# EAGLE design design1 (EAGLE 9.5.1)

## Sheet 1 of 2: MCU
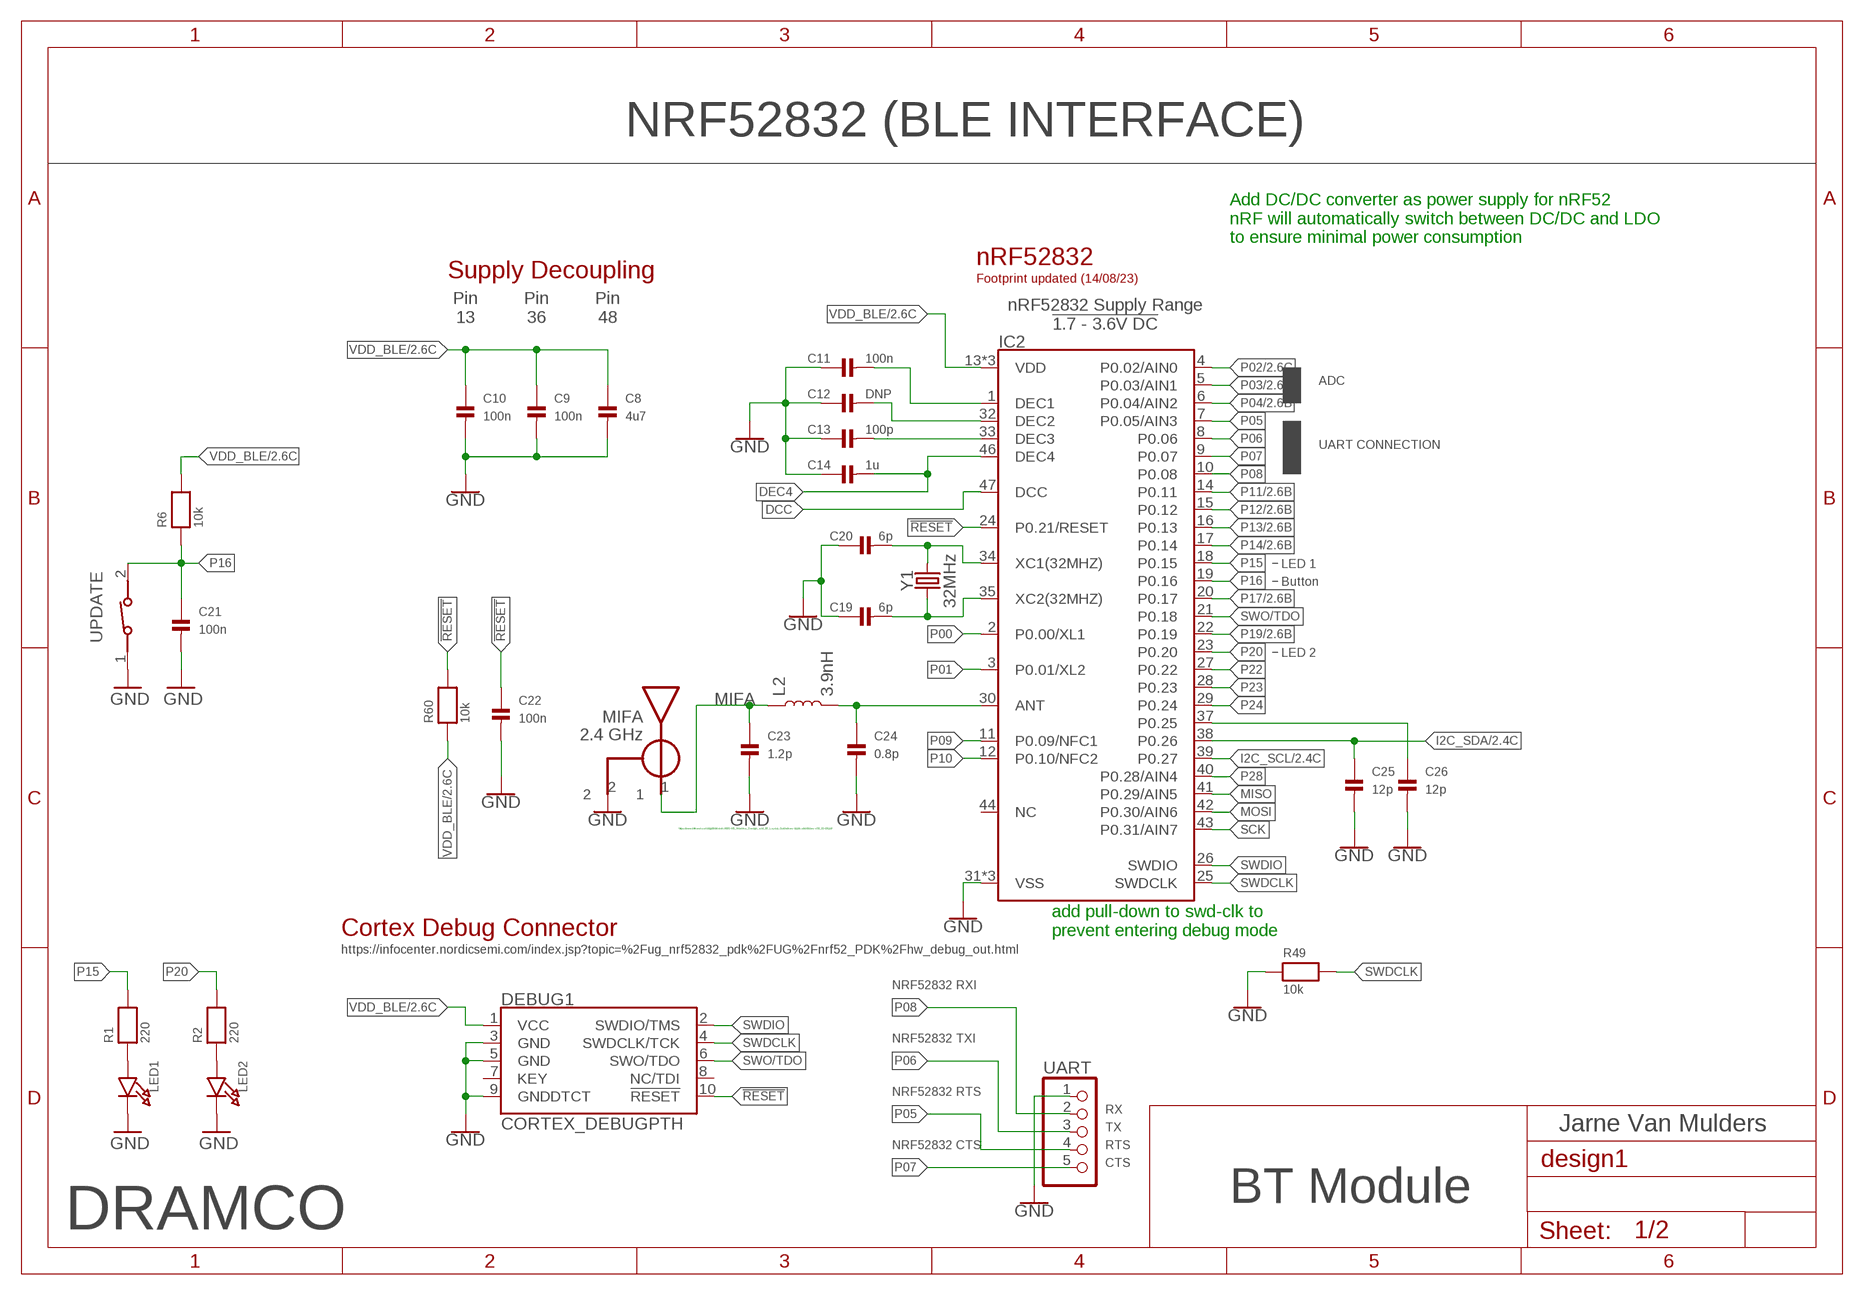
[diagram p0: schematic, sheet 1]

### Parts
C8  4u7  CAP_CERAMIC0603  [0603]
C9  100n  CAP_CERAMIC0402  [0402]
C10  100n  CAP_CERAMIC0402  [0402]
C11  100n  CAP_CERAMIC0402  [0402]
C12  DNP  CAP_CERAMIC0402  [0402]
C13  100p  CAP_CERAMIC0402  [0402]
C14  1u  CAP_CERAMIC0402  [0402]
C19  6p  CAP_CERAMIC0402  [0402]
C20  6p  CAP_CERAMIC0402  [0402]
C21  100n  CAP_CERAMIC0402  [0402]
C22  100n  CAP_CERAMIC0402  [0402]
C23  1.2p  CAP_CERAMIC0402  [0402]
C24  0.8p  CAP_CERAMIC0402  [0402]
C25  12p  CAP_CERAMIC0402  [0402]
C26  12p  CAP_CERAMIC0402  [0402]
DEBUG1  CORTEX_DEBUGPTH  [2X5-PTH-1.27MM]
IC2  NRF52832-EXTENDED  [QFN48-6X6MM-EXTENDED]
L2  3.9nH  INDUCTOR-0402-3.9NH  [0402]
LED1  LED0805  [CHIPLED_0805]
LED2  LED0805  [CHIPLED_0805]
R1  220  RESISTOR0603  [0603]
R2  220  RESISTOR0603  [0603]
R6  10k  RESISTOR0402  [0402]
R49  10k  RESISTOR0402  [0402]
R60  10k  RESISTOR0402  [0402]
U$18  BLE-ANT  [ANT-2G4]
UART  HEADER-1X5ROUND  [1X05_ROUND]
UPDATE  434111043826  [434111043826]
Y1  32MHz  CRYSTAL-32MHZ-SMD-2.0X1.6MM  [CRYSTAL-SMD-2.0X1.6MM]

### Nets
!RESET!: C22.1 DEBUG1.10(!RESET) IC2.24(P0.21/RESET) R60.2
ANT: C24.1 IC2.30(ANT) L2.2
DCC: IC2.47(DCC)
DEC4: C14.2 IC2.46(DEC4)
DEC5: C11.2 IC2.1(DEC1)
DEC6: C12.2 IC2.32(DEC2)
DEC8: C13.2 IC2.33(DEC3)
GND: C8.2 C9.2 C10.2 C11.1 C12.1 C13.1 C14.1 C19.1 C20.1 C21.2 C22.2 C23.2 C24.2 C25.2 C26.2 DEBUG1.3(GND) DEBUG1.5(GND) DEBUG1.9(GNDDTCT) IC2.31(VSS) IC2.45(VSS) IC2.EP(VSS) LED1.C LED2.C R49.1 U$18.2 UART.1 UPDATE.1 ; also sheet 2
I2C_SCL: IC2.39(P0.27) ; also sheet 2
I2C_SDA: C25.1 IC2.38(P0.26) ; also sheet 2
MIFA: C23.1 L2.1 U$18.1
MISO: IC2.41(P0.29/AIN5)
MOSI: IC2.42(P0.30/AIN6)
N$1: LED2.A R2.1
N$20: LED1.A R1.1
N$50: C26.1 IC2.37(P0.25)
P00: IC2.2(P0.00/XL1)
P01: IC2.3(P0.01/XL2)
P02: IC2.4(P0.02/AIN0) ; also sheet 2
P03: IC2.5(P0.03/AIN1) ; also sheet 2
P04: IC2.6(P0.04/AIN2) ; also sheet 2
P05: IC2.7(P0.05/AIN3) UART.4
P06: IC2.8(P0.06) UART.3
P07: IC2.9(P0.07) UART.5
P08: IC2.10(P0.08) UART.2
P09: IC2.11(P0.09/NFC1)
P10: IC2.12(P0.10/NFC2)
P11: IC2.14(P0.11) ; also sheet 2
P12: IC2.15(P0.12) ; also sheet 2
P13: IC2.16(P0.13) ; also sheet 2
P14: IC2.17(P0.14) ; also sheet 2
P15: IC2.18(P0.15) R1.2
P16: C21.1 IC2.19(P0.16) R6.1 UPDATE.2
P17: IC2.20(P0.17) ; also sheet 2
P19: IC2.22(P0.19) ; also sheet 2
P20: IC2.23(P0.20) R2.2
P22: IC2.27(P0.22)
P23: IC2.28(P0.23)
P24: IC2.29(P0.24)
P28: IC2.40(P0.28/AIN4)
SCK: IC2.43(P0.31/AIN7)
SWDCLK: DEBUG1.4(SWDCLK/TCK) IC2.25(SWDCLK) R49.2
SWDIO: DEBUG1.2(SWDIO/TMS) IC2.26(SWDIO)
SWO/TDO: DEBUG1.6(SWO/TDO) IC2.21(P0.18)
VDD_BLE: C8.1 C9.1 C10.1 DEBUG1.1(VCC) IC2.13(VDD) IC2.36(VDD) IC2.48(VDD) R6.2 R60.1 ; also sheet 2
XC1: C20.2 IC2.34(XC1(32MHZ)) Y1.3
XC2: C19.2 IC2.35(XC2(32MHZ)) Y1.1
Unconnected: DEBUG1.7(KEY) DEBUG1.8(NC/TDI) IC2.44(NC)

### Notes on the sheet
- NRF52832 (BLE INTERFACE)
- Add DC/DC converter as power supply for nRF52
  nRF will automatically switch between DC/DC and LDO
  to ensure minimal power consumption
- nRF52832
- Supply Decoupling
- Footprint updated (14/08/23)
- nRF52832 Supply Range
  !1.7 - 3.6V DC!
- Pin
  13
- Pin
  36
- Pin
  48
- ADC
- UART CONNECTION
- LED 1
- Button
- LED 2
- https://www.infineon.com/dgdl/Infineon-AN91445_Antenna_Design_and_RF_Layout_Guidelines-ApplicationNotes-v09_00-EN.pdf
- Cortex Debug Connector
- add pull-down to swd-clk to 
  prevent entering debug mode
- https://infocenter.nordicsemi.com/index.jsp?topic=%2Fug_nrf52832_pdk%2FUG%2Fnrf52_PDK%2Fhw_debug_out.html
- NRF52832 RXI
- NRF52832 TXI
- NRF52832 RTS
- RX
- TX | Jarne Van Mulders
- NRF52832 CTS | RTS
- CTS
- BT Module
- DRAMCO

## Sheet 2 of 2
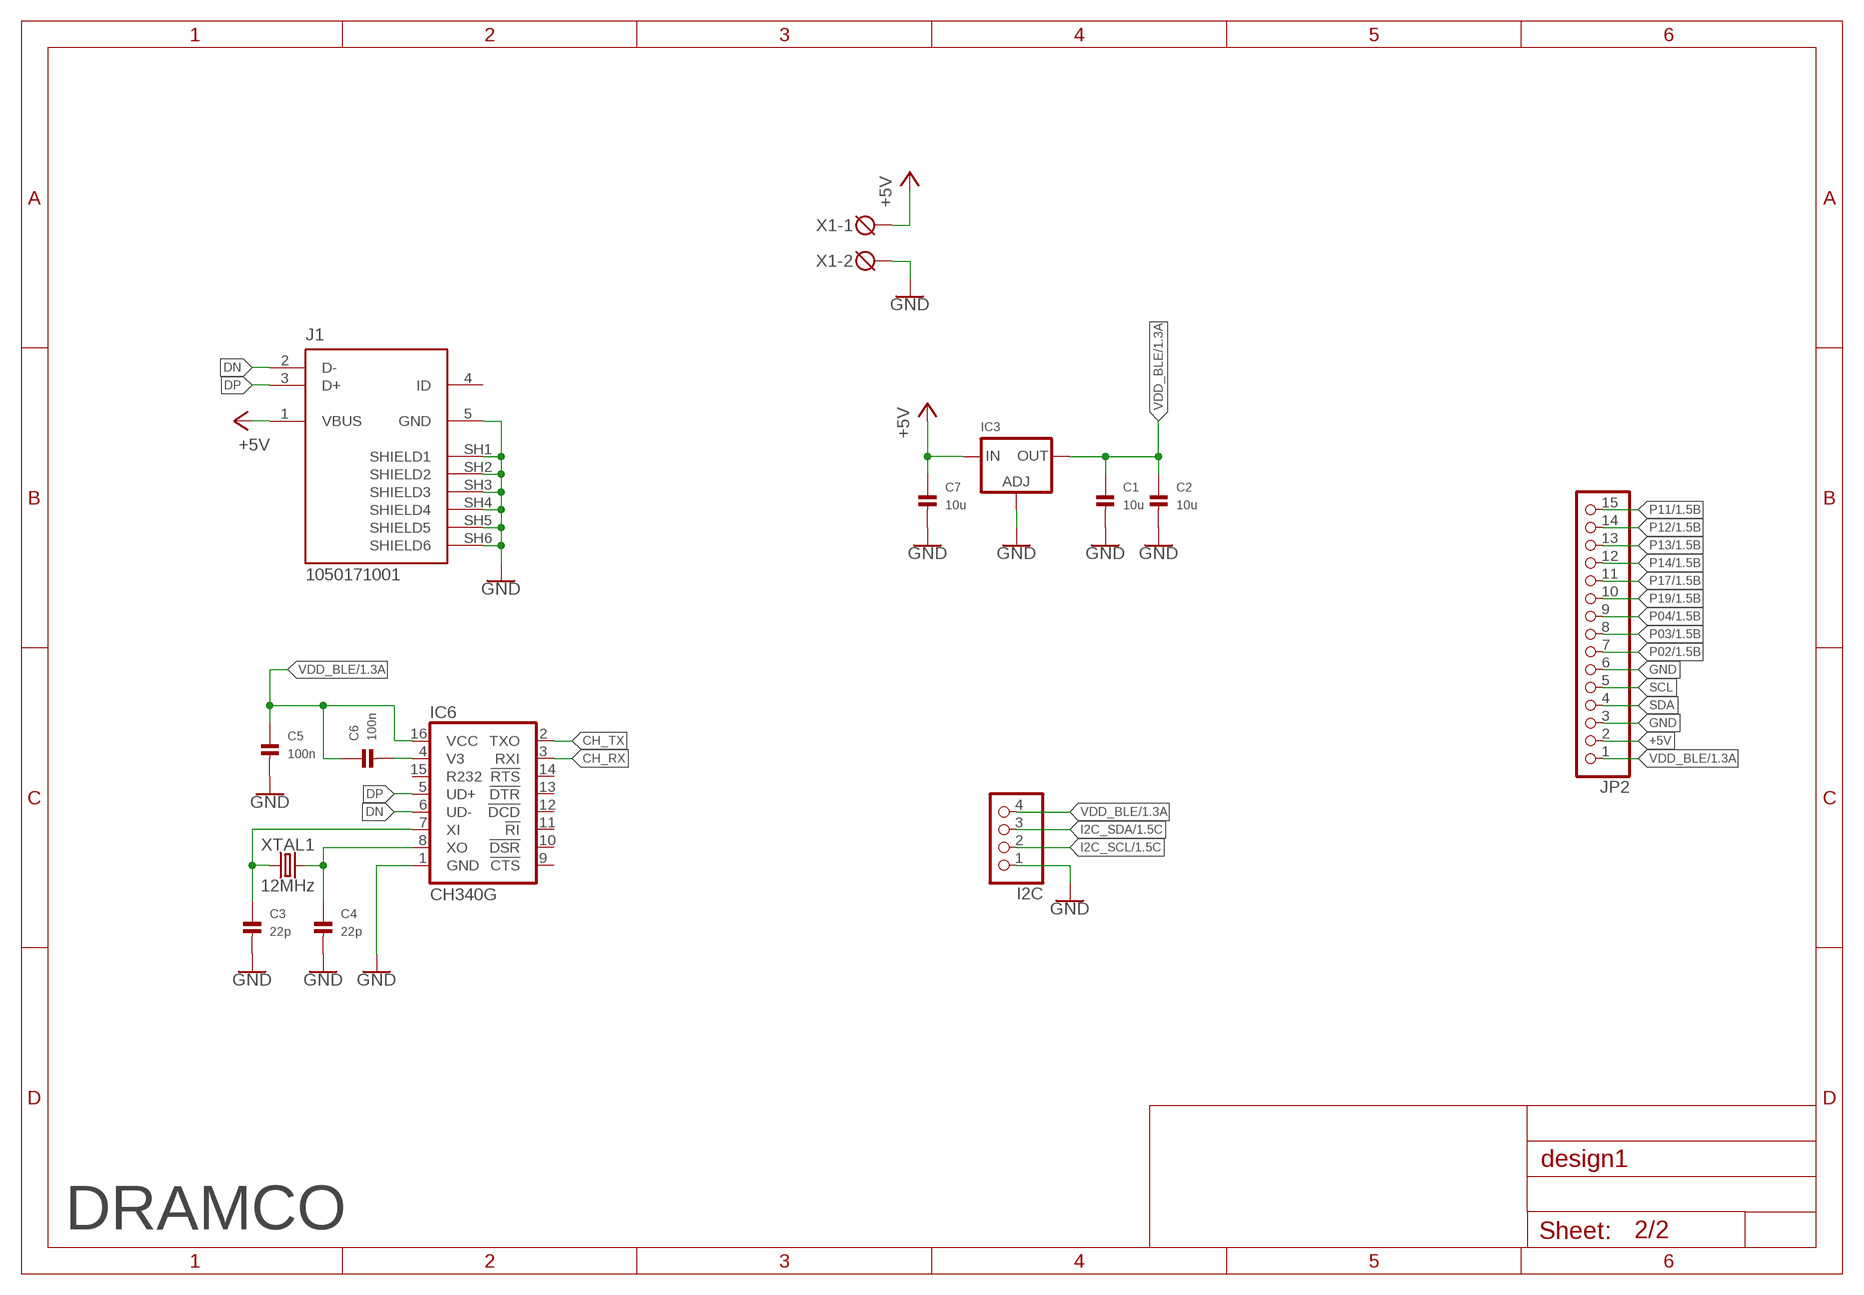
[diagram p1: schematic, sheet 2]

### Parts
C1  10u  CAP_CERAMIC0805  [0805]
C2  10u  CAP_CERAMIC0805  [0805]
C3  22p  CAP_CERAMIC0402  [0402]
C4  22p  CAP_CERAMIC0402  [0402]
C5  100n  CAP_CERAMIC0402  [0402]
C6  100n  CAP_CERAMIC0402  [0402]
C7  10u  CAP_CERAMIC0805  [0805]
I2C  HEADER-1X4ROUND  [1X04_ROUND]
IC3  LM1117SOT223-REFLOW  [SOT223-R]
IC6  CH340G  CH340GSMD  [SO016]
J1  1050171001  [MOLEX_1050171001]
JP2  HEADER-1X15  [1X15_ROUND_70]
X1  DG3XX-02-3.5  [DG350-3.5-02P]
XTAL1  12MHz  CRYSTALSMD-3.2X2.5  [CRYSTAL-SMD-3.2X2.5MM]

### Nets
+5V: C7.1 IC3.3(IN) J1.1(VBUS) JP2.2 X1.1
CH_RX: IC6.3(RXI)
CH_TX: IC6.2(TXO)
DN: IC6.6(UD-) J1.2(D-)
DP: IC6.5(UD+) J1.3(D+)
GND: C1.2 C2.2 C3.2 C4.2 C5.2 C7.2 I2C.1 IC3.1(ADJ) IC6.1(GND) J1.5(GND) J1.SH1(SHIELD1) J1.SH2(SHIELD2) J1.SH3(SHIELD3) J1.SH4(SHIELD4) J1.SH5(SHIELD5) J1.SH6(SHIELD6) JP2.3 JP2.6 X1.2 ; also sheet 1
I2C_SCL: I2C.2 ; also sheet 1
I2C_SDA: I2C.3 ; also sheet 1
N$29: C3.1 IC6.7(XI) XTAL1.1
N$32: C4.1 IC6.8(XO) XTAL1.3
N$34: C6.2 IC6.4(V3)
P02: JP2.7 ; also sheet 1
P03: JP2.8 ; also sheet 1
P04: JP2.9 ; also sheet 1
P11: JP2.15 ; also sheet 1
P12: JP2.14 ; also sheet 1
P13: JP2.13 ; also sheet 1
P14: JP2.12 ; also sheet 1
P17: JP2.11 ; also sheet 1
P19: JP2.10 ; also sheet 1
SCL: JP2.5
SDA: JP2.4
VDD_BLE: C1.1 C2.1 C5.1 C6.1 I2C.4 IC3.2(OUT) IC6.16(VCC) JP2.1 ; also sheet 1
Unconnected: IC6.9(!CTS) IC6.10(!DSR) IC6.11(!RI) IC6.12(!DCD) IC6.13(!DTR) IC6.14(!RTS) IC6.15(R232) J1.4(ID)

### Notes on the sheet
- DRAMCO

## Library data of the parts
C1-C14 C19-C26 = microbuilder:CAP_CERAMIC: Ceramic Capacitors 0402 - 0402 Surface Mount Capacitors 16pF 50V 5% [Digikey: 445-4899-2-ND] 18pF 50V 5% [Digikey: 490-1281-2-ND] 22pF 50V 5% [Digikey: 490-1283-2-ND] 68pF 50V 5% [Digikey: 490-1289-2-ND] 0.1uF 10V 10% [Digikey: 490-1318-2-ND] 1.0uF 6.3V 10% [Digikey: 490-1320-2-ND] 0603 - 0603 Surface Mount Capacitors 16 pF 50V 5% [Digikey: 445-5051-2-ND] 22 pF 50V [Digikey: PCC220ACVTR-ND] 33 pF 50V 5% [Digikey: 490-1415-1-ND] 56pF 50V 5% [Digikey: 490-1421-1-ND] 220pF 50V 5% [Digikey: 445-1285-1-ND] 680 pF 50V 2200 pF 50V 5% C0G [Digikey: 445-1297-1-ND] 5600 pF 100V 5% X7R [Digikey: 478-3711-1-ND] 0.1 µF 25V 10% [Digikey: PCC2277TR-ND] 0.22 µF 16V 10% X7R [Digikey: 445-1318-1-ND] 1.0 µF 25V 10% [Digikey: 445-5146-2-ND] 0603 - RF Specific 3pF 250V +/-0.1pF RF [Digikey: 712-1347-1-ND] 18 pF 250V 5% [Digikey: 478-3505-1-ND or 712-1322-1-ND] 56 pF 250V 5% C0G RF [Digikey: 490-4867-1-ND] 68 pF 250V RF [Digikey: 490-4868-1-ND] 0805 - 0805 Surface Mount Capacitors 220 pF 250V 2% RF Ceramic Capacitor [Digikey: 712-1398-1-ND] 1000 pF 50V 2% NP0 Ceramic Capacitor [Digikey: 478-3760-1-ND] 0.1 µF 25V 10% Ceramic Capacitor [Digikey: PCC1828TR-ND] 1.0 µF 16V 10% Ceramic Capacitor[Digikey: 490-1691-2-ND] 10.0 µF 10V 10% Ceramic Capacitor[Digikey: 709-1228-1-ND] 10.0 uF 16V 10% Ceramic Capacitor [Digikey: 478-5165-2-ND] 47 uF 6.3V 20% Ceramic Capacitor [Digikey: 587-1779-1-ND or 399-5506-1-ND] 1206 - 1206 Surface Mount Capacitors 47uF 10V 20% Ceramic Capacitor [Digikey: 490-5528-1-ND or 399-5508-1-ND or 445-6010-1-ND] 100uF 6.3V -20%, +80% Y5V Ceramic Capacitor (Digikey: 490-4512-1-ND, Mouser: 81-GRM31CF50J107ZE1L)
DEBUG1 = SparkFun-Connectors:CORTEX_DEBUG: Cortex Debug Connector Datasheet <http://infocenter.arm.com/help/topic/com.arm.doc.faqs/attached/13634/cortex_debug_connectors.pdf>
I2C = microbuilder:HEADER-1X4: PIN HEADER
IC2 = SparkFun-RF:NRF52832-EXTENDED
IC3 = microbuilder:LM1117: LM1117 Voltage Regulator LM1117 Adjustable Voltage regulator [Digikey: LM1117IMP-ADJDKR-ND] LM1117 3.3V Voltage regulator [AP1117E33GDIDKR-ND] LM1117 5.0V Voltage regulator [AP1117E50GDIDKR-ND] SOT223-REFLOW - SOT223 package for solder paste/reflow ovens SOT223-WAVE - SOT223 package for hand-soldering (larger pads) Note: For the fixed-voltage regulators, simply set the ADJ pin to GND.
IC6 = SparkFun-IC-Comms:CH340G: A simple USB 2.0 to Serial IC.; PROD_ID: IC-13498
J1 = 1050171001:1050171001: Check availability <https://pricing.snapeda.com/parts/1050171001/Molex/view-part?ref=eda>; AVAILABILITY: In Stock; CHECK_PRICES: https://www.snapeda.com/parts/1050171001/Molex/view-part/?ref=eda; DESCRIPTION: USB - micro B USB 2.0 Receptacle Connector 5 Position Surface Mount, Right Angle; MF: Molex; MP: 1050171001; PACKAGE: None; PRICE: None; SNAPEDA_LINK: https://www.snapeda.com/parts/1050171001/Molex/view-part/?ref=snap
JP2 = microbuilder:HEADER-1X15: 1x15 Header
L2 = nrf52832-breakout-temp:INDUCTOR: Inductors Resist changes in electrical current. Basically a coil of wire. SparkFun Products: SparkFun Load Cell Amplifier - HX711 <https://www.sparkfun.com/products/13879> IOIO-OTG - V2.2 <https://www.sparkfun.com/products/13613>; PROD_ID: NDUC-13457
LED1 LED2 = microbuilder:LED: LED 0603 - 0603 Surface Mount Package 2mA: Green LED - Low Power (3.9mcd, 2ma, 1.7Vf) - Digikey: 475-2709-2-ND Orange LED - Low Power (9.8mcd, 2ma, 1.8Vf) - Digikey: 475-1194-2-ND Red LED - Low Power (5mcd, 2ma, 1.8Vf) - Digikey: 475-1195-2-ND Yellow LED - Low Power (7mcd, 2ma, 1.8Vf) - Digikey: 475-1196-2-ND 5mA: Blue LED - Low Power (17mcd, 5ma, 2.9Vf) - Digikey: LNJ937W8CRACT-ND 0805 - 0805 Surface Mount Package 2mA: Red LED (8.8mcd, 2mA, 1.8Vf, Clear) - Low Power [Digikey: 475-2510-1-ND] Green LED (5mcd, 2mA, 1.8Vf, Clear) - Low Power [Digikey: 475-2730-1-ND] Yellow LED (11.3mcd, 2mA, 1.8Vf, Clear) - Low Power [Digikey: 475-2555-1-ND] 20mA: Red LED (104mcd, 20mA, Diffused) - LS R976 [Digikey: 475-1278-6-ND] Red LED (12mcd, 20mA, 2.0Vf, Clear) - APT2012EC [Digikey: 754-1128-1-ND] Green LED (15mcd, 20mA, 2.2Vf, Clear) - APT2012GC [Digikey: 754-1131-1-ND] Orange LED (160mcd, 20mA, 2.1Vf, Clear) - APT2012SECK [Digikey: 754-1130-1-ND] 1206 - 1206 Surface Mount Package Green LED (26mcd, 20mA, Diffused) - LG N971 [Digikey: 475-1407-6-ND] Red LED (15mcd, 20mA, Diffused) - LH N974 [Digikey: 475-1416-6-ND]
R1 R2 R6 R49 R60 = microbuilder:RESISTOR: Resistors 0402 - 0402 Surface Mount Package 22 Ohm 1% 1/16W [Digikey: 311-22.0LRTR-ND] 33 Ohm 5% 1/16W 1.0K 5% 1/16W 1.5K 5% 1/16W 2.0K 1% 1/16W 10.0K 1% 1/16W [Digikey: 311-10.0KLRTR-ND] 10.0K 5% 1/16W [Digikey: RMCF0402JT10K0TR-ND] 12.1K 1% 1/16W [Digikey: 311-22.0LRTR-ND] 100.0K 5% 1/16W 0603 - 0603 Surface Mount Package 0 Ohm 1/10 Watt 1% Resistor 15 Ohm 1/10 Watt 1% Resistor 33 Ohm 1/10 Watt 1% Resistor 49.9 Ohm 1/10 Watt 1% Resistor 100 Ohm 1/10 Watt 1% Resistor 150 Ohm 1/10 Watt 1% Resistor 240 Ohm 1/10 Watt 1% Resistor 390 Ohm 1/10 Watt 1% Resistor 560 Ohm 1/10 Watt 1% Resistor 680 Ohm 1/10 Watt 1% Resistor 750 Ohm 1/10 Watt 1% Resistor 1.0K Ohm 1/10 Watt 1% Resistor 1.5K Ohm 1/10 Watt 1% Resistor 2.0K Ohm 1/10 Watt 1% Resistor 2.2K Ohm 1/10 Watt 1% Resistor 3.3K Ohm 1/10 Watt 1% Resistor 4.7K Ohm 1/10 Watt 1% Resistor 10.0K Ohm 1/10 Watt 1% Resistor 12.0K Ohm 1/10 Watt 1% Resistor 12.1K Ohm 1/10 Watt 1% Resistor 20.0K Ohm 1/10 Watt 1% Resistor 33.0K Ohm 1/10 Watt 1% Resistor 100.0K Ohm 1/10 Watt 1% Resistor 0805 - 0805 Surface Mount Package 0 Ohm 1/8 Watt 1% Resistor 33 Ohm 1/8 Watt 1% Resistor 100 Ohm 1/8 Watt 1% Resistor 150 Ohm 1/8 Watt 1% Resistor 200 Ohm 1/8 Watt 1% Resistor 240 Ohm 1/8 Watt 1% Resistor 330 Ohm 1/8 Watt 1% Resistor 390 Ohm 1/8 Watt 1% Resistor 470 Ohm 1/8 Watt 1% Resistor 1.0K Ohm 1/8 Watt 1% Resistor 1.5K Ohm 1/8 Watt 1% Resistor 2.0K Ohm 1/8 Watt 1% Resistor 4.7K Ohm 1/8 Watt 1% Resistor 5.1K Ohm 1/8 Watt 1% Resistor 5.6K Ohm 1/8 Watt 1% Resistor 10.0K Ohm 1/8 Watt 1% Resistor 22.0K Ohm 1/8 Watt 1% Resistor 33.0K Ohm 1/8 Watt 1% Resistor 100K Ohm 1/8 Watt 1% Resistor 1206 - 1206 Surface Mount Package 2012 - 2010 Surface Mount Package 0.11 Ohm 1/2 Watt 1% Resistor - Digikey: RHM.11UCT-ND
U$18 = ble-antenna:BLE-ANT
UART = microbuilder:HEADER-1X5: PIN HEADER
UPDATE = Eagle_SWITCHES (rev18c):434111043826: 6.0x3.5 mm SMD WS-TASV <http://katalog.we-online.de/media/images/v2/Family_WS-TASV_6.0x3.jpg> Details see: http://katalog.we-online.de/em/datasheet/4341x1xxx8x6.pdf 2015 (C) Wurth Elektronik
X1 = degson:DG3XX-02: DG350-3.5-02P DG306-5.0-02P
XTAL1 = SparkFun-Clocks:CRYSTAL: Crystals (Generic) These are passive quartz crystals, which can be used as a clock source for a microcontroller. Crystal's are two-terminal devices. They require external "load" capacitors to generate an oscillating signal.
Y1 = nrf52832-breakout-temp:CRYSTAL-32MHZ: 32MHz Crystal Digikey Example <http://www.digikey.com/product-detail/en/murata-electronics-north-america/XRCGB32M000F2P00R0/490-9769-1-ND/4952013> Frequency: 32MHz Frequency Stability: ±20ppm Frequency Tolerance: ±20ppm Load Capacitance: 6pF; PROD_ID: XTAL-13459

## Board
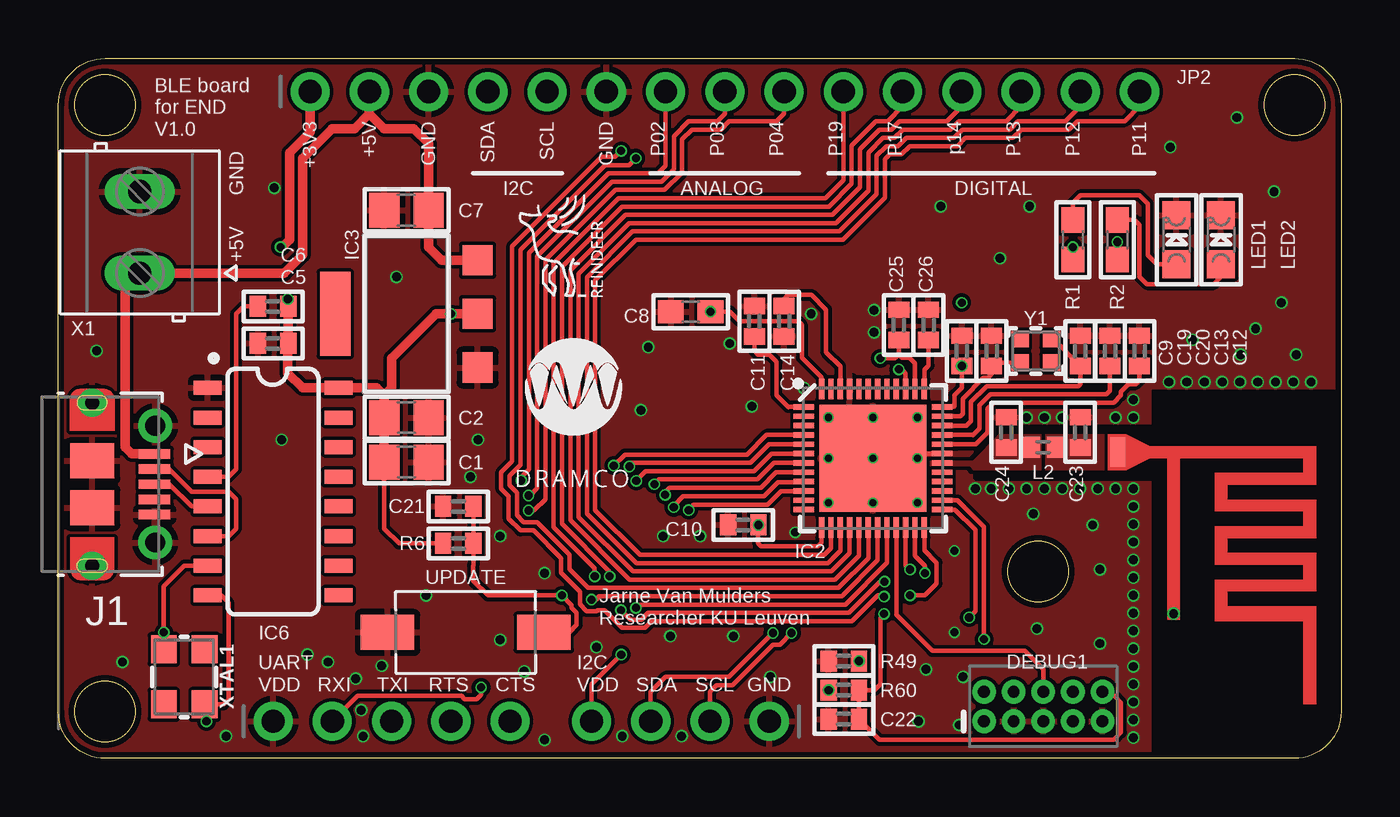
[diagram p2: board, top side]
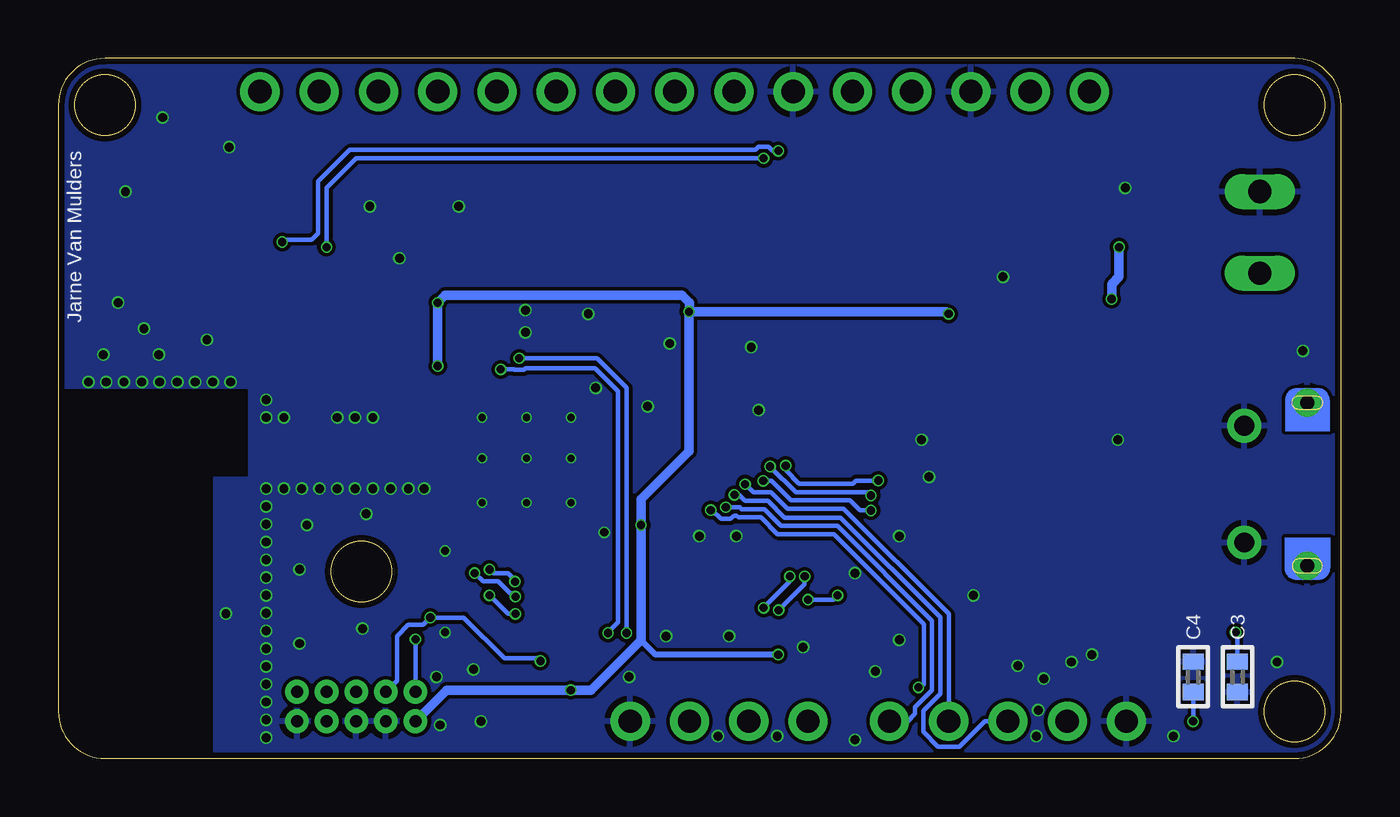
[diagram p3: board, bottom side, seen from below]

Size 55 x 30 mm. Coordinates in mm from the lower left corner, seen from the top.
Outline: 0,2 0,28 arc-90 2,30 53,30 arc-90 55,28 55,2 arc-90 53,0 2,0 arc-90 0,2
Outline: circle at 2,28 radius 1.3
Outline: circle at 2,2 radius 1.3
Outline: circle at 53,28 radius 1.3
Outline: circle at 42,8 radius 1.3
Copper layers (1*16): Top 0.035mm / dielectric 1.5mm / Bottom 0.035mm
Design rules "SeeedStudio_2layer_DRU_no_angle_20140221-2 *": minimum track width 6mil, minimum drill 12mil, track to track 6mil, track to pad 6mil, pad to pad 6mil, via to via 6mil, smd to smd 0mil, copper to edge 10mil, drill to drill 10mil, minimum pad ring 10mil, minimum via ring 2mil, stop-mask expansion 2mil, vias tented up to drill 100mil, thermal gap 10mil
tRestrict: area 39.4,12 to 46.8,12.1; area 40,14.1 to 46.8,14.2

### Footprints (pad centres in the part's own frame; a part is rotated, then mirrored left to right if it is on the bottom)
0805 = smd 1.3 x 1.5: 1 -0.95,0; 2 0.95,0
0402 = smd 0.7 x 0.9: 1 -0.65,0; 2 0.65,0
0603 = smd 1.1 x 1: 1 -0.85,0; 2 0.85,0
2X5-PTH-1.27MM = drill 0.508 pad 1: 1 -2.54,-0.635; 2 -2.54,0.635; 3 -1.27,-0.635; 4 -1.27,0.635; 5 0,-0.635; 6 0,0.635; 7 1.27,-0.635; 8 1.27,0.635; 9 2.54,-0.635; 10 2.54,0.635
1X04_ROUND = drill 1 pad 1.676: 1 -3.81,0; 2 -1.27,0; 3 1.27,0; 4 3.81,0
QFN48-6X6MM-EXTENDED = smd 0.88 x 0.23: 1 -2.96,2.2; 2 -2.96,1.8; 3 -2.96,1.4; 4 -2.96,1; 5 -2.96,0.6; 6 -2.96,0.2; 7 -2.96,-0.2; 8 -2.96,-0.6; 9 -2.96,-1; 10 -2.96,-1.4; 11 -2.96,-1.8; 12 -2.96,-2.2; 25 2.96,-2.2; 26 2.96,-1.8; 27 2.96,-1.4; 28 2.96,-1; 29 2.96,-0.6; 30 2.96,-0.2; 31 2.96,0.2; 32 2.96,0.6; 33 2.96,1; 34 2.96,1.4; 35 2.96,1.8; 36 2.96,2.2 | smd 0.23 x 0.88: 13 -2.2,-2.96; 14 -1.8,-2.96; 15 -1.4,-2.96; 16 -1,-2.96; 17 -0.6,-2.96; 18 -0.2,-2.96; 19 0.2,-2.96; 20 0.6,-2.96; 21 1,-2.96; 22 1.4,-2.96; 23 1.8,-2.96; 24 2.2,-2.96; 37 2.2,2.96; 38 1.8,2.96; 39 1.4,2.96; 40 1,2.96; 41 0.6,2.96; 42 0.2,2.96; 43 -0.2,2.96; 44 -0.6,2.96; 45 -1,2.96; 46 -1.4,2.96; 47 -1.8,2.96; 48 -2.2,2.96 | smd 4.6 x 4.6: EP 0,0
SOT223-R = smd 1.3 x 1.3: 1 -2.3,-3.05; 2 0,-3.05; 3 2.3,-3.05 | smd 3.6 x 1.3: 4 0,3.05
SO016 = smd 0.6 x 1.2: 1 -4.445,-2.8; 2 -3.175,-2.8; 3 -1.905,-2.8; 4 -0.635,-2.8; 5 0.635,-2.8; 6 1.905,-2.8; 7 3.175,-2.8; 8 4.445,-2.8; 9 4.445,2.8; 10 3.175,2.8; 11 1.905,2.8; 12 0.635,2.8; 13 -0.635,2.8; 14 -1.905,2.8; 15 -3.175,2.8; 16 -4.445,2.8
MOLEX_1050171001 = smd 0.4 x 1.35: 1 -1.3,4.125; 2 -0.65,4.125; 3 0,4.125; 4 0.65,4.125; 5 1.3,4.125 | drill 0.85 pad 1.45: SH1 -2.5,4.15; SH2 2.5,4.15 | drill 0.6 pad 1.2: SH3 -3.5,1.45; SH6 3.5,1.45 | smd 1.5 x 1.9: SH4 -1,1.45; SH5 1,1.45
1X15_ROUND_70 = drill 1 pad 1.676: 1 -17.78,0; 2 -15.24,0; 3 -12.7,0; 4 -10.16,0; 5 -7.62,0; 6 -5.08,0; 7 -2.54,0; 8 0,0; 9 2.54,0; 10 5.08,0; 11 7.62,0; 12 10.16,0; 13 12.7,0; 14 15.24,0; 15 17.78,0
0402' = smd 0.85 x 0.9: 1 -0.58,0; 2 0.58,0
CHIPLED_0805 = smd 1.2 x 1.2: A 0,-1.05; C 0,1.05
ANT-2G4 = smd 1.27 x 0.635: 1 0.241,-8.496 | smd 0.025 x 0.025: 2 7.417,-5.842
1X05_ROUND = drill 1 pad 1.676: 1 -5.08,0; 2 -2.54,0; 3 0,0; 4 2.54,0; 5 5.08,0
434111043826 = smd 2.3 x 1.5: 1 -3.35,0; 2 3.35,0
DG350-3.5-02P = drill 1 long: 1 -1.75,0; 2 1.75,0
CRYSTAL-SMD-3.2X2.5MM = smd 1.2 x 1.1: 1 -1.175,-0.875; 2 1.175,-0.875; 3 1.175,0.875; 4 -1.175,0.875
CRYSTAL-SMD-2.0X1.6MM = smd 0.75 x 0.7: 1 -0.675,-0.5; 2 0.675,-0.5; 3 0.675,0.5; 4 -0.675,0.5

### Placement (x,y rotation side)
C1  14.92,12.7 0 top
C2  14.92,14.61 0 top
C3  4.45,3.49 270 bottom
C4  6.35,3.49 90 bottom
C5  9.21,17.78 180 top
C6  9.21,19.37 180 top
C7  14.92,23.5 180 top
C8  27.11,19.14 180 top
C9  38.73,17.46 90 top
C10  29.37,10 180 top
C11  29.84,18.73 270 top
C12  46.35,17.46 270 top
C13  45.09,17.46 270 top
C14  31.11,18.73 90 top
C19  40.01,17.46 270 top
C20  43.81,17.46 270 top
C21  17.14,10.79 180 top
C22  33.68,1.68 180 top
C23  43.81,13.97 90 top
C24  40.64,13.97 90 top
C25  36.04,18.57 90 top
C26  37.31,18.57 90 top
DEBUG1  42.23,2.22 0 top
I2C  26.67,1.59 180 top
IC2  34.92,12.86 0 top
IC3  14.92,19.05 90 top
IC6  9.21,11.43 270 top
J1  0,11.75 270 top
JP2  28.57,28.57 0 top
L2  3.9nH  [0402']  42.23,13.34 180 top
LED1  47.94,22.23 0 top
LED2  49.85,22.23 0 top
R1  43.5,22.23 270 top
R2  45.4,22.23 270 top
R6  17.14,9.21 180 top
R49  33.68,4.17 0 top
R60  33.68,2.92 0 top
U$18  53.91,13.37 270 top
UART  14.29,1.59 0 top
UPDATE  17.46,5.4 0 top
X1  3.49,22.54 90 top
XTAL1  5.4,3.49 270 top
Y1  41.91,17.46 0 top

### Tracks (layer width: path | path; a pad name or v marks a point on that pad's centre or on a via)
!RESET!  (via drill 0.35)
  Top 0.203: v36.51,6.99 37.15,6.99 37.65,7.49 37.65,8.38 37.12,8.91 IC2.24 | v35.4,6.19 35.24,6.03 35.24,3.17 34.99,2.92 R60.2 C22.1 35.21,0.79 45.24,0.79 45.56,1.11 45.56,2.38 45.24,2.7 44.93,2.7 DEBUG1.10
  Bottom 0.203: v36.51,6.99 35.72,6.19 v35.4,6.19
+5V
  Top 0.406: IC3.3 16.43,21.35 15.87,21.91 C7.1 15.87,26.36 15.24,26.99 13.97,26.99 13.34,27.62 | 13.34,27.62 12.7,26.99 11.75,26.99 10.48,25.72 10.48,21.59 9.68,20.79 X1.1 2.86,20.16 2.86,13.34 3.15,13.05 J1.1 | 13.34,27.62 JP2.2
ANT
  pour Top (no thermals): 37.38,12.76 39.24,12.76 40.35,13.88 42.13,13.88 42.13,12.36 39.26,12.36 39.1,12.51 37.38,12.51
DEC4
  Top 0.203: C14.2 31.11,19.68 31.29,19.86 32.29,19.86 32.92,19.23 32.92,17.41 33.52,16.8 IC2.46
DEC5
  Top 0.203: C11.2 29.84,17.46 30,17.3 30.48,17.3 30.8,16.99 30.8,15.56 31.3,15.06 IC2.1
DEC6
  Top 0.203: C12.2 46.35,16.19 46.2,16.03 45.88,16.03 45.56,15.72 45.56,15.56 45.24,15.24 40.1,15.24 39.84,14.98 39.84,13.99 39.85,13.98 39.85,13.97 39.33,13.46 IC2.32
DEC8
  Top 0.203: C13.2 45.09,15.75 44.93,15.6 39.95,15.6 39.48,15.13 39.48,14.13 39.21,13.86 IC2.33
DN
  Top 0.203: IC6.6 7.3,9.53 7.62,9.84 7.62,11.11 7.3,11.43 5.71,11.43 4.75,12.4 J1.2
DP
  Top 0.203: J1.3 4.76,11.75 5.71,10.79 IC6.5
GND  (via drill 0.31, 0.35, 0.38)
  Top 0.025: v47.83,6.2 U$18.2
  Top 0.152: v47.82,6.2 v47.83,6.2
  Top 0.203: IC2.31 37.03,13.06 v36.83,12.86
  other vias: 46.09,11.56 45.33,11.56 46.09,10.79 46.09,10.03 46.09,9.27 46.09,8.51 46.09,7.75 46.09,6.99 46.09,6.22 46.09,5.46 46.09,4.7 46.09,3.94 46.09,3.17 46.09,14.61 45.33,14.61 46.09,15.37 44.56,11.56 43.8,11.56 43.04,11.56 42.28,11.56 41.52,11.56 40.75,11.56 42.28,14.61 43.04,14.61 41.52,14.61 33.02,14.61 36.83,14.61 33.02,12.86 33.02,10.95 34.92,10.95 36.83,10.95 47.61,16.13 48.37,16.13 49.14,16.13 49.9,16.13 50.66,16.13 51.42,16.13 52.18,16.13 52.95,16.13 53.71,16.13 46.09,2.41 46.09,1.65 46.09,0.89 38.42,8.89 38.42,5.4 34.98,19.21 34.98,18.26 31.96,15.88 28.78,17.78 29.74,15.08 25.93,9.53 27.51,9.53 28.94,5.24 26.24,5.24 30.53,3.49 26.72,0.95 24.18,0.95 20.85,0.79 36.88,1.59 38.79,3.49 41.96,5.56 41.8,10.48 44.66,8.1 44.34,10 44.66,4.92 48.63,17.94 50.69,17.3 51.33,18.41 53.07,17.3 39.99,11.56 39.31,11.56 24.97,14.92 25.29,17.62 9.58,13.65 10.69,4.45 9.26,24.45 14.5,20.64 34.92,12.86 34.92,14.61 2.75,4.13 1.64,17.46 31.59,9.68 13.86,3.97 15.77,6.99 17.67,12.06 37.2,3.81 38.63,1.43 11.56,4.13 12.75,3.41 12.99,2.06 13.07,0.95 19.97,3.73 17.99,13.65 20.85,7.94 18.94,9.53 18.94,5.08 7.19,0.95 23.07,4.76 37.83,23.65 40.37,21.43 41.64,23.65 47.68,26.19 50.53,27.46 52.12,24.29 52.44,19.53 32.28,19.05
  pour Bottom: 48.3,-3.8 48.3,12.03 46.79,12.03 46.79,15.88 56.2,15.88 56.2,34.13 -5.4,34.13 -5.4,-3.8
  pour Top (isolate 0.076, rank 2): 46.8,15.86 46.8,-4.76 -1.11,-4.76 -1.11,39.09 55.97,39.09 55.97,15.86
I2C_SCL  (via drill 0.35)
  Top 0.203: v36.04,16.67 36.17,16.67 36.33,16.51 IC2.39 | v31.43,5.38 30.93,4.88 30.64,4.88 28.9,3.14 28.22,3.14 27.94,2.86 I2C.2
  Bottom 0.203: v36.04,16.67 35.47,16.67 35.45,16.65 35.04,16.65 34.97,16.71 31.98,16.71 30.99,15.73 30.99,5.84 31.43,5.4 v31.43,5.38
I2C_SDA  (via drill 0.35)
  Top 0.203: C25.1 36.04,17.3 | 36.04,17.3 35.88,17.14 v35.24,17.14 | v30.64,5.38 28.76,3.49 26.04,3.49 25.4,2.86 I2C.3 | 36.04,17.3 36.17,17.17 36.49,17.17 36.73,16.93 IC2.38
  Bottom 0.203: v35.24,17.14 31.91,17.14 30.64,15.88 v30.64,5.38
MIFA
  pour Top (no thermals): 42.33,13.88 45.1,13.88 45.1,12.36 42.33,12.36
N$1
  Top 0.203: R2.1 46.14,23.07 46.35,22.86 46.35,20.64 46.67,20.32 49.53,20.32 49.85,20.64 LED2.A
N$20
  Top 0.203: LED1.A 47.09,21.18 46.71,21.55 46.71,23.77 46.35,24.13 43.81,24.13 43.5,23.81 R1.1
N$29  (via drill 0.35)
  Top 0.203: IC6.7 5.4,8.26 4.52,7.38 v4.52,5.4 XTAL1.1
  Bottom 0.203: C3.1 4.45,5.32 v4.52,5.4
N$32  (via drill 0.35)
  Top 0.203: XTAL1.3 6.35,2.32 | 6.35,2.32 7.08,2.32 7.3,2.54 7.3,6.67 6.99,6.99 IC6.8 | v6.35,1.59 6.35,2.32
  Bottom 0.203: C4.1 v6.35,1.59
N$34
  Top 0.203: IC6.4 7.3,12.06 7.62,12.38 7.62,19.05 7.94,19.37 C6.2
N$50
  Top 0.203: C26.1 37.31,16.83 37.12,16.64 IC2.37
P02  (via drill 0.35)
  Top 0.203: v23.81,12.54 24.29,13.02 29.53,13.02 30.37,13.86 IC2.4 | v19.84,11.91 19.84,12.05 20.17,12.38 20.17,21.66 23.59,25.07 25.7,25.07 26.04,25.4 JP2.7
  Bottom 0.203: v19.84,11.91 20.8,11.91 20.94,11.76 23.24,11.76 23.81,12.34 v23.81,12.54
P03  (via drill 0.35)
  Top 0.203: v24.48,12.51 24.45,12.54 24.57,12.66 29.68,12.66 30.47,13.46 IC2.5 | v20.16,11.26 20.22,11.26 20.53,11.58 20.53,21.51 23.73,24.71 25.85,24.71 26.39,25.25 26.39,26.67 27.03,27.3 28.26,27.3 28.57,27.62 JP2.8
  Bottom 0.203: v24.48,12.51 23.38,11.41 20.3,11.41 v20.16,11.26
P04  (via drill 0.35)
  Top 0.203: v24.78,11.89 24.77,11.91 25.16,12.31 29.82,12.31 30.57,13.06 IC2.6 | v20.16,10.62 20.39,10.62 20.89,11.11 20.89,21.36 23.88,24.36 26,24.36 26.75,25.11 26.75,26.52 27.17,26.95 28.41,26.95 28.76,27.3 30.8,27.3 31.11,27.62 JP2.9
  Bottom 0.203: v24.78,11.89 24.43,11.89 23.59,11.05 21.05,11.05 20.64,10.64 20.16,10.64 v20.16,10.62
P05  (via drill 0.35)
  Top 0.203: v25.56,11.75 25.76,11.95 29.97,11.95 30.68,12.66 IC2.7
  Bottom 0.203: v25.56,11.75 25.2,11.39 24.44,11.39 23.74,10.7 21.33,10.7 16.83,6.19 UART.4
P06  (via drill 0.35)
  Top 0.203: v26.01,11.29 26.01,11.41 26.19,11.59 27.15,11.59 27.15,11.6 30.12,11.6 30.78,12.26 IC2.8
  Bottom 0.203: v26.01,11.29 25.81,11.29 25.55,11.04 24.59,11.04 23.87,10.32 21.46,10.32 17.18,6.04 17.18,2.78 17.92,2.04 17.92,1.14 17.28,0.49 16.38,0.49 15.28,1.59 UART.3
P07  (via drill 0.35)
  Top 0.203: v26.39,10.76 26.39,10.83 26.79,11.23 30.26,11.23 30.85,11.83 31.93,11.83 IC2.9
  Bottom 0.203: v26.39,10.76 25.78,10.76 25.7,10.68 24.73,10.68 24.01,9.96 21.61,9.96 17.54,5.9 17.54,2.92 18.27,2.19 18.27,1.91 18.58,1.6 18.59,1.59 UART.5
P08  (via drill 0.35)
  Top 0.203: v27.03,10.64 26.99,10.64 27.23,10.88 30.41,10.88 30.98,11.46 IC2.10 | v18.12,3.04 18.12,2.73 17.94,2.54 17.42,2.54 17.28,2.68 12.84,2.68 UART.2
  Bottom 0.203: v27.03,10.64 26.97,10.64 26.59,10.26 26.18,10.26 26.04,10.4 25.93,10.4 25.85,10.33 24.88,10.33 24.16,9.61 21.75,9.61 17.89,5.75 17.89,3.17 18.05,3.02 18.1,3.02 v18.12,3.04
P11
  Top 0.203: IC2.14 33.12,8.99 32.85,8.72 24.93,8.72 23.02,10.64 23.02,20.48 24.77,22.23 33.63,22.23 35.43,24.03 35.43,25.67 35.65,25.88 36.15,25.88 36.51,26.24 38.54,26.24 38.9,26.59 40.94,26.59 41.29,26.95 43.33,26.95 43.68,27.3 45.72,27.3 46.35,27.94 JP2.15
P12
  Top 0.203: IC2.15 33.52,8.89 33,8.37 24.78,8.37 22.66,10.49 22.66,20.63 24.62,22.58 33.48,22.58 35.08,24.18 35.08,25.82 35.5,26.24 36,26.24 36.36,26.59 38.4,26.59 38.75,26.95 40.79,26.95 41.14,27.3 43.18,27.3 43.81,27.94 JP2.14
P13
  Top 0.203: IC2.16 33.92,8.79 33.15,8.01 24.64,8.01 22.31,10.34 22.31,20.77 24.47,22.94 33.34,22.94 34.72,24.32 34.72,25.96 35.35,26.59 35.85,26.59 36.21,26.95 38.25,26.95 38.6,27.3 40.64,27.3 41.27,27.94 JP2.13
P14
  Top 0.203: IC2.17 34.33,8.69 33.3,7.66 24.49,7.66 21.95,10.19 21.95,20.92 24.32,23.29 33.19,23.29 34.37,24.47 34.37,26.11 35.2,26.95 35.71,26.95 36.06,27.3 38.1,27.3 38.73,27.94 JP2.12
P15  (via drill 0.35)
  Top 0.203: IC2.18 34.73,8.58 33.44,7.3 22.7,7.3 21.91,8.1 21.91,8.73 20.52,10.12 19.95,10.12 19.66,10.41 19.66,11.38 19.34,11.7 19.34,12.11 19.82,12.59 19.82,21.8 23.44,25.43 24.47,25.43 v24.77,25.72 | v43.5,21.91 R1.2
  Bottom 0.203: v24.77,25.72 42.23,25.72 43.5,24.45 v43.5,21.91
P16  (via drill 0.35)
  Top 0.203: IC2.19 35.12,8.48 33.59,6.95 23.19,6.95 23.05,6.8 v22.86,6.8 | C21.1 R6.1 17.8,8.27 17.78,8.26 17.78,7.62 18.41,6.99 v21.59,6.99 22,6.57 22,6.45 22.23,6.23 22.23,5.71 21.91,5.4 UPDATE.2
  Bottom 0.203: v22.86,6.8 21.77,6.8 v21.59,6.99
P17  (via drill 0.35)
  Top 0.203: v24.77,6.45 24.77,6.51 24.85,6.59 33.74,6.59 35.52,8.38 IC2.20 | v23.64,7.8 23.64,8 21.6,10.05 21.6,21.07 24.18,23.65 33.04,23.65 34.01,24.62 34.01,26.26 35.06,27.3 35.56,27.3 36.2,27.94 JP2.11
  Bottom 0.203: v24.77,6.45 23.65,7.56 23.65,7.79 v23.64,7.8
P19  (via drill 0.35)
  Top 0.203: v35.42,7.57 35.22,7.57 33.89,6.24 25.29,6.24 25,5.95 24.53,5.95 v24.13,6.35 v24.12,6.35 | v23,7.8 23,8.14 21.24,9.9 21.24,21.21 24.03,24 32.89,24 33.66,24.77 JP2.10 | IC2.22 36.33,8.28 v36.51,8.1
  Bottom 0.203: v36.51,8.1 36.35,7.94 35.72,7.94 35.4,7.62 35.4,7.59 v35.42,7.57 | v24.12,6.35 23.02,7.45 23.02,7.78 v23,7.8
P20  (via drill 0.35)
  Top 0.203: v35.4,6.93 35.4,6.99 35.14,6.99 34.03,5.87 25.43,5.87 25.15,5.59 24.17,5.59 23.42,6.35 23.11,6.35 23.07,6.3 22.65,6.3 22.36,6.6 22.36,7.01 22.37,7.02 22.37,7.13 21.55,7.95 21.55,8.58 20.37,9.77 19.81,9.77 19.31,10.27 19.31,11.23 18.99,11.55 18.99,12.26 19.46,12.73 19.46,21.95 23.29,25.78 23.88,25.78 v24.13,26.04 | v37.16,7.94 37.16,8.25 36.73,8.68 IC2.23 | v45.4,22.13 R2.2
  Bottom 0.203: v35.4,6.93 35.55,7.07 35.63,7.07 36.14,7.58 36.79,7.58 v37.15,7.94 v37.16,7.94 | v24.13,26.04 24.38,26.04 24.56,26.22 24.97,26.22 25.11,26.07 42.51,26.07 43.85,24.73 43.85,22.5 44.13,22.23 45.3,22.23 v45.4,22.13
P22
  Top 0.203: IC2.27 37.92,11.43 IC2.27
SWDCLK  (via drill 0.35)
  Top 0.203: v39.05,6.03 39.32,6.3 39.32,9.79 38.45,10.66 IC2.25
  Bottom 0.203: DEBUG1.4 40.48,3.33 40.48,5.24 40.01,5.71 39.37,5.71 v39.05,6.03 37.62,6.03 35.88,4.29 34.45,4.29 R49.2
  other vias: 34.33,4.17
SWDIO  (via drill 0.35)
  Top 0.203: v39.69,5.1 39.69,9.92 38.55,11.06 IC2.26
  Bottom 0.203: DEBUG1.2 v39.69,5.1
SWO/TDO
  Top 0.203: DEBUG1.6 42.23,3.81 41.43,4.6 37.47,4.6 35.92,6.15 IC2.21
VDD_BLE  (via drill 0.35)
  Top 0.152: v24.13,4.45 v24.14,4.45
  Top 0.203: C9.1 38.73,15.89 38.42,15.57 38.42,15.08 38.4,15.06 IC2.36 | C8.1 28.8,19.14 29.21,18.73 31.72,18.73 31.88,18.57 31.88,17.17 32.73,16.33 IC2.48 | C10.1 30,9.99 30,9.21 30.13,9.08 32.58,9.08 32.73,9.23 IC2.13 | I2C.4 22.86,3.17 v24.13,4.45 | R6.2 14.61,9.21 13.97,9.84 C1.1
  Top 0.406: C1.1 C2.1 13.97,15.55 | 13.97,15.55 13.65,15.88 IC6.16 10.48,15.88 9.84,16.51 9.84,17.77 C5.1 C6.1 9.86,19.67 v9.84,19.68 | IC3.2 v16.83,19.05 16.19,19.05 14.29,17.14 14.29,15.87 13.97,15.55 | JP2.1 10.79,26.82 9.92,25.95 9.92,22.23 9.6,21.91 v9.53,21.91
  Bottom 0.203: C8.1 27.92,19.14 | 27.92,19.14 27.88,19.1 27.92,19.14
  Bottom 0.254: v24.14,4.45 29.4,4.45 30.02,5.07
  Bottom 0.406: C9.1 v38.73,19.53 38.42,19.84 28.26,19.84 27.94,19.53 27.94,19.16 C8.1 | C8.1 27.96,13.15 30.02,11.1 C10.1 30.02,5.07 32.16,2.92 R60.1 38.35,2.92 DEBUG1.1 | C8.1 27.92,19.14 16.92,19.14 v16.83,19.05 | v9.53,21.91 9.53,20.64 9.84,20.32 v9.84,19.68
  other vias: 38.73,16.81 27.96,19.14 30.02,10 33.03,2.92
XC1
  Top 0.203: Y1.3 42.67,17.96 43.21,17.42 43.21,17.41 C20.2 43.81,16.03 43.73,15.95 39.81,15.95 39.13,15.27 39.13,14.45 38.94,14.26 IC2.34
XC2
  Top 0.203: Y1.1 40.16,16.96 C19.2 40.01,16.47 39.85,16.31 39.66,16.31 38.77,15.42 38.77,14.76 38.66,14.66 IC2.35

### Text on the board
tPlace: +3V3 | +5V | GND | SDA | SCL | GND | P02 | P03 | P04 | P19 | P17 | p14 | P13 | P12 | P11 | C:/Users/jarne/OneDrive - KU Leuven/011-Logos/logo-text-black (4).bmp | Jarne Van Mulders | Researcher KU Leuven
bPlace: Jarne Van Mulders
tNames: BLE board / for END | V1.0 | GND | I2C | ANALOG | DIGITAL | +5V | VDD | RXI | TXI | RTS | CTS | VDD | SDA | SCL | GND